# EAGLE design schematic (EAGLE 6.4)
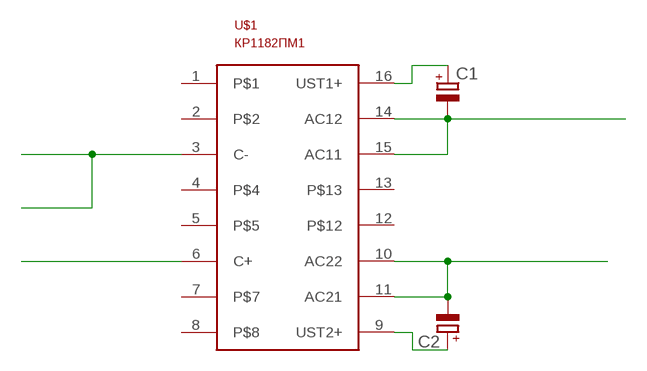
[diagram p0: schematic, sheet 1]

## Parts
C1  CPOL-EUE2.5-5  [E2,5-5]
C2  CPOL-EUE2.5-5  [E2,5-5]
U$1  КР1182ПМ1  [DIL16]

## Nets
N$1: C1.- U$1.14(AC12) U$1.15(AC11)
N$2: C2.- U$1.10(AC22) U$1.11(AC21)
N$3: C1.+ U$1.16(UST1+)
N$4: C2.+ U$1.9(UST2+)
N$5: U$1.3(C-)
N$6: U$1.6(C+)
Unconnected: U$1.1 U$1.2 U$1.4 U$1.5 U$1.7 U$1.8 U$1.12 U$1.13

## Library data of the parts
C1 C2 = resistor:CPOL-EU: POLARIZED CAPACITOR, European symbol
U$1 = mylib:КР1182ПМ1

## Board
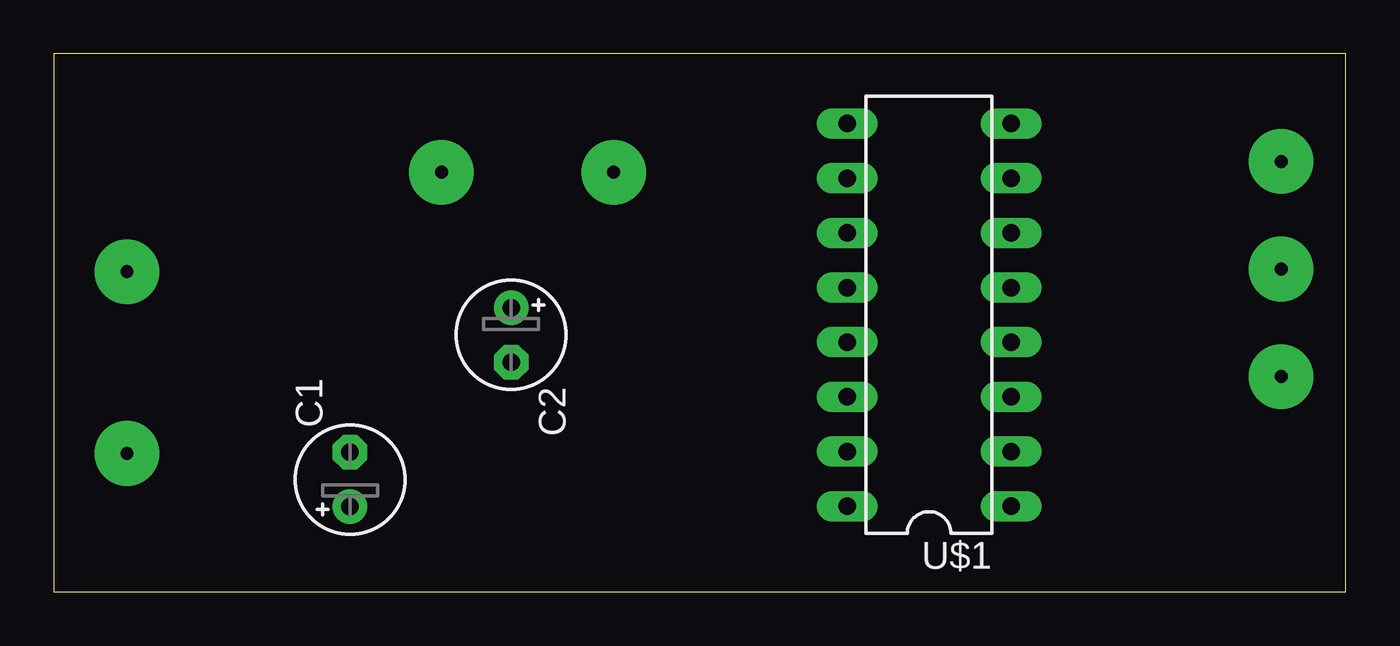
[diagram p1: board, top side]
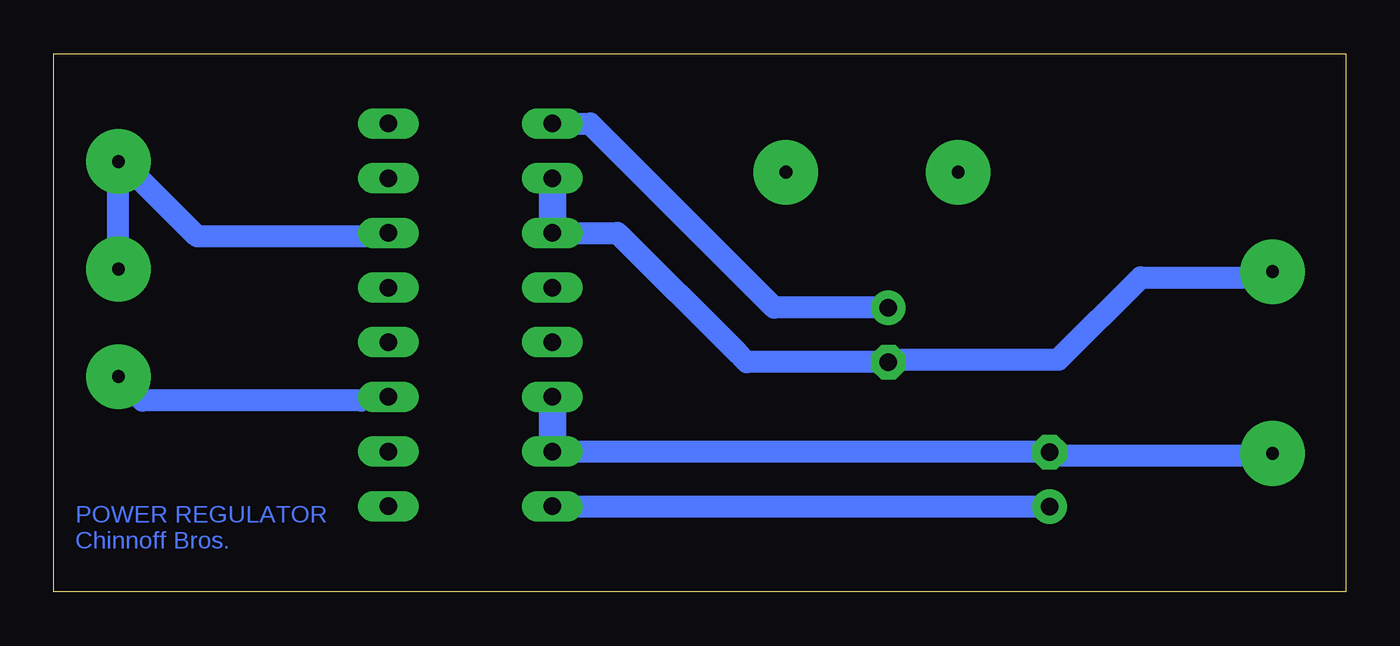
[diagram p2: board, bottom side, seen from below]

Size 60 x 25 mm. Coordinates in mm from the lower left corner, seen from the top.
Outline: 0,0 60,0 60,25 0,25 0,0
Copper layers (1*16): Top 0.035mm / dielectric 1.5mm / Bottom 0.035mm
Design rules "default": minimum track width 10mil, minimum drill 32mil, track to track 12mil, track to pad 12mil, pad to pad 12mil, via to via 12mil, smd to smd 8mil, copper to edge 40mil, drill to drill 40mil, minimum pad ring 12mil, minimum via ring 12mil, stop-mask expansion 4mil, vias tented up to drill 0mil, thermal gap 20mil

### Footprints (pad centres in the part's own frame; a part is rotated, then mirrored left to right if it is on the bottom)
E2,5-5 = drill 0.813 pad 1.6: + -1.27,0 | drill 0.813 pad 1.6 octagon: - 1.27,0
DIL16 = drill 0.813 long: 1 -8.89,-3.81; 2 -6.35,-3.81; 3 -3.81,-3.81; 4 -1.27,-3.81; 5 1.27,-3.81; 6 3.81,-3.81; 7 6.35,-3.81; 8 8.89,-3.81; 9 8.89,3.81; 10 6.35,3.81; 11 3.81,3.81; 12 1.27,3.81; 13 -1.27,3.81; 14 -3.81,3.81; 15 -6.35,3.81; 16 -8.89,3.81

### Placement (x,y rotation side)
C1  13.76,5.22 90 top
C2  21.24,11.94 270 top
U$1  40.65,12.87 90 top

### Tracks (layer width: path | path; a pad name or v marks a point on that pad's centre or on a via)
N$1
  Bottom 1.016: U$1.15 13.79,6.52 C1.-
  Bottom 1.27: U$1.14 U$1.15
N$2
  Bottom 1.016: U$1.11 33.83,16.68 28.26,11.11 27.94,10.79 27.82,10.67 C2.-
  Bottom 1.27: U$1.10 U$1.11
N$3
  Bottom 1.016: U$1.16 13.79,3.98 C1.+
N$4
  Bottom 1.016: C2.+ 26.55,13.21 35.09,21.76 U$1.9
N$7  (via drill 0.6 pad 3)
  other vias: 18,19.5 3.4,14.88 3.4,6.43
N$8  (via drill 0.6 pad 3)
  Bottom 1.016: v57,15 v57,20
  other vias: 26,19.5 57,10
N$9
  Bottom 1.016: 45.09,16.51 53.34,16.51 56.52,19.68
N$12
  Bottom 1.016: 45.72,8.89 55.88,8.89 57.15,10.16
N$13
  Bottom 1.016: 13.34,6.35 3.81,6.35
N$14
  Bottom 1.016: 20.95,10.79 13.34,10.79 9.53,14.61 3.81,14.61

### Text on the board
Bottom: POWER REGULATOR / Chinnoff Bros.